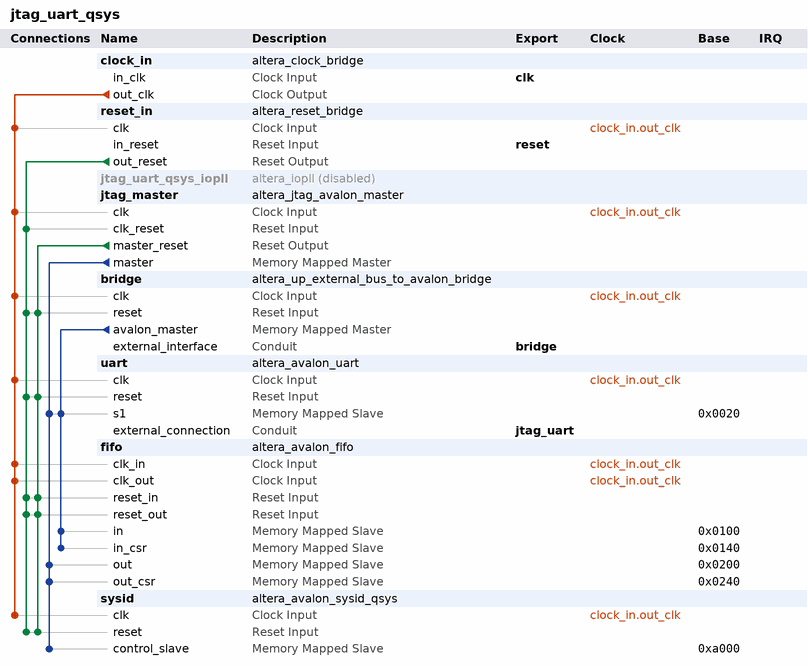
[diagram p0: system contents]
# Platform Designer (Qsys) system jtag_uart_qsys, Arria 10 10AX027H4F34I3SG
# Parameters at their usual value, and those the tool derives, are not listed.
package require -exact qsys 1.0
create_system jtag_uart_qsys
set_project_property DEVICE_FAMILY {Arria 10}
set_project_property DEVICE 10AX027H4F34I3SG

add_component clock_in ip/jtag_uart_qsys_clock_in.ip altera_clock_bridge clock_in 19.1

add_component reset_in ip/jtag_uart_qsys_reset_in.ip altera_reset_bridge reset_in 19.1

add_component jtag_uart_qsys_iopll ip/jtag_uart_qsys_iopll.ip altera_iopll jtag_uart_qsys_iopll 19.3.0
set_instance_property jtag_uart_qsys_iopll ENABLED false

add_component jtag_master ip/jtag_uart_qsys_jtag_master.ip altera_jtag_avalon_master jtag_master 19.1

add_component bridge ip/jtag_uart_qsys_bridge.ip altera_up_external_bus_to_avalon_bridge bridge 18.0

add_component uart ip/jtag_uart_qsys_uart.ip altera_avalon_uart uart 19.1

add_component fifo ip/jtag_uart_qsys_fifo.ip altera_avalon_fifo fifo 19.1

add_component sysid ip/jtag_uart_qsys_sysid.ip altera_avalon_sysid_qsys sysid 19.1

# connections
add_connection clock_in.out_clk bridge.clk clock
add_connection clock_in.out_clk fifo.clk_in clock
add_connection clock_in.out_clk fifo.clk_out clock
add_connection clock_in.out_clk jtag_master.clk clock
add_connection clock_in.out_clk reset_in.clk clock
add_connection clock_in.out_clk sysid.clk clock
add_connection clock_in.out_clk uart.clk clock
add_connection jtag_master.master_reset bridge.reset reset
add_connection jtag_master.master_reset fifo.reset_in reset
add_connection jtag_master.master_reset fifo.reset_out reset
add_connection jtag_master.master_reset sysid.reset reset
add_connection jtag_master.master_reset uart.reset reset
add_connection reset_in.out_reset bridge.reset reset
add_connection reset_in.out_reset fifo.reset_in reset
add_connection reset_in.out_reset fifo.reset_out reset
add_connection reset_in.out_reset jtag_master.clk_reset reset
add_connection reset_in.out_reset sysid.reset reset
add_connection reset_in.out_reset uart.reset reset
add_connection bridge.avalon_master fifo.in avalon
set_connection_parameter_value bridge.avalon_master/fifo.in baseAddress 0x0100
add_connection bridge.avalon_master fifo.in_csr avalon
set_connection_parameter_value bridge.avalon_master/fifo.in_csr baseAddress 0x0140
add_connection bridge.avalon_master uart.s1 avalon
set_connection_parameter_value bridge.avalon_master/uart.s1 baseAddress 0x0020
add_connection jtag_master.master fifo.out avalon
set_connection_parameter_value jtag_master.master/fifo.out baseAddress 0x0200
add_connection jtag_master.master fifo.out_csr avalon
set_connection_parameter_value jtag_master.master/fifo.out_csr baseAddress 0x0240
add_connection jtag_master.master sysid.control_slave avalon
set_connection_parameter_value jtag_master.master/sysid.control_slave baseAddress 0xa000
add_connection jtag_master.master uart.s1 avalon
set_connection_parameter_value jtag_master.master/uart.s1 baseAddress 0x0020

# exported interfaces
add_interface bridge conduit end
set_interface_property bridge EXPORT_OF bridge.external_interface
add_interface clk clock sink
set_interface_property clk EXPORT_OF clock_in.in_clk
add_interface jtag_uart conduit end
set_interface_property jtag_uart EXPORT_OF uart.external_connection
add_interface reset reset sink
set_interface_property reset EXPORT_OF reset_in.in_reset

save_system jtag_uart_qsys.qsys
